# Altium schematic sheet IWatch_MB.SchDoc
size A2; DocStatus: Draft
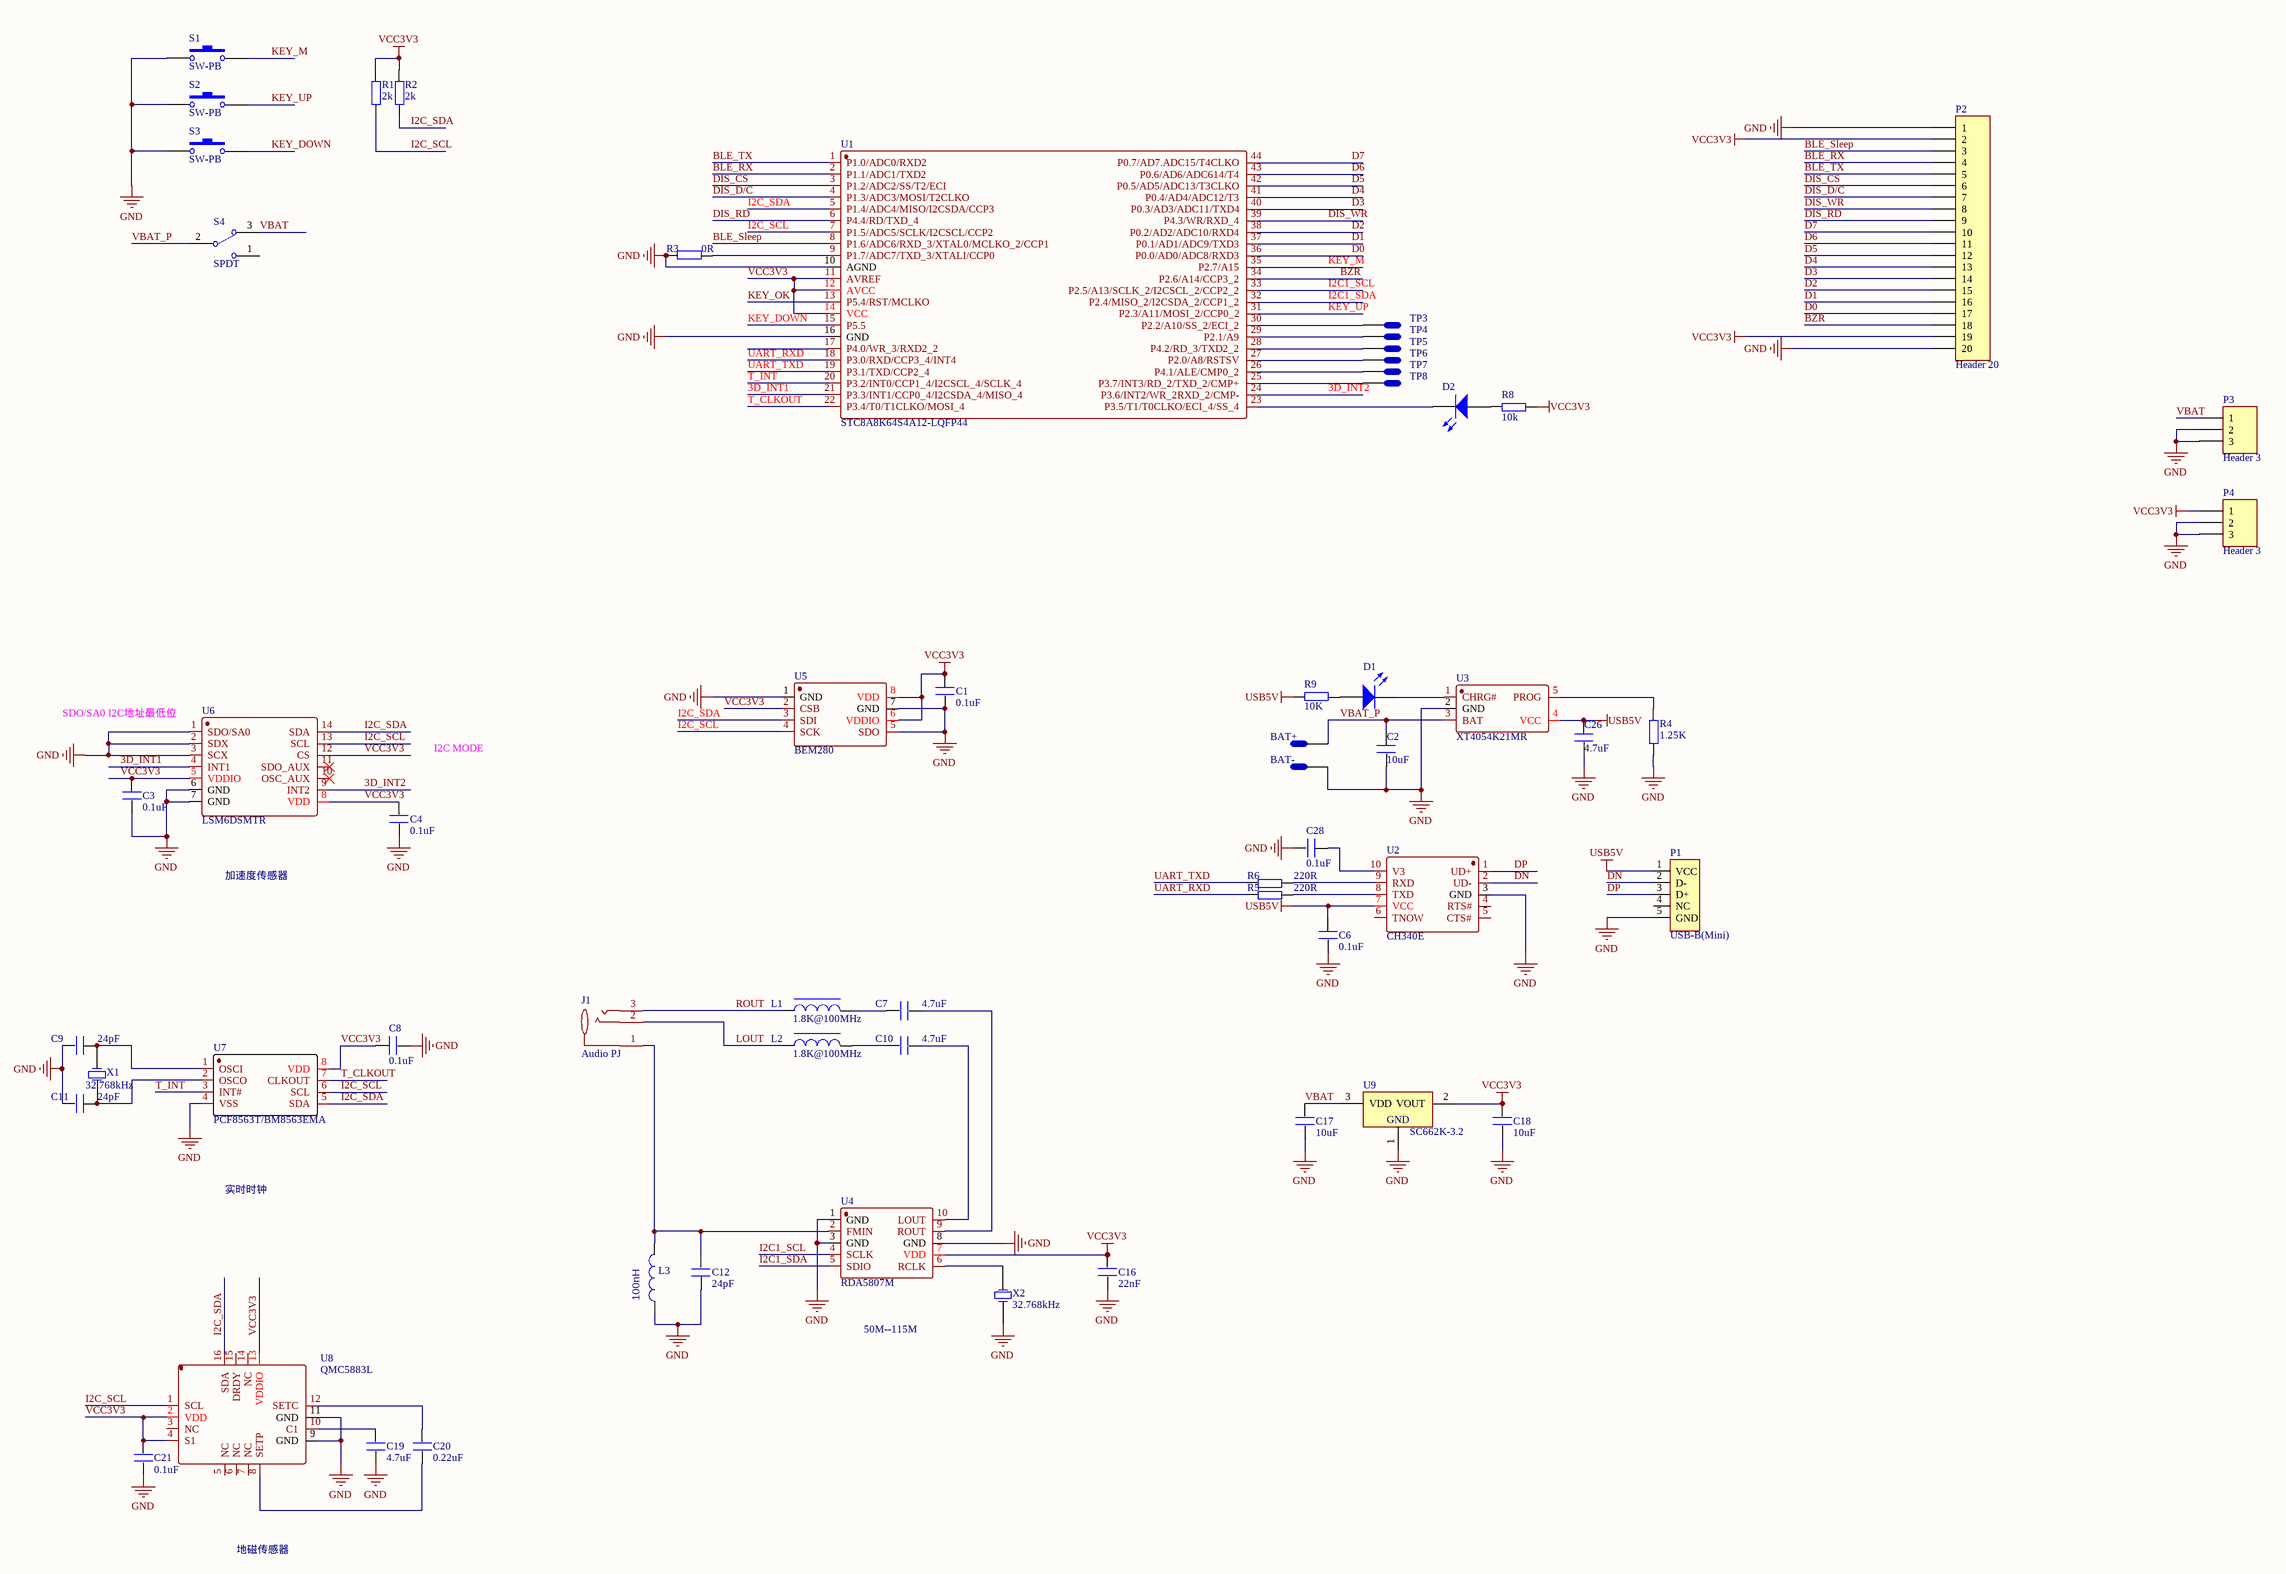
[diagram p0: IWatch_MB.SchDoc]

## Parts
BAT+  TP  [TP_1mm]  (value not drawn)
BAT-  TP  [TP_1mm]  (value not drawn)
C1  0.1uF  [C0603]
C2  10uF  [C0603]
C3  0.1uF  [C0603]
C4  0.1uF  [C0603]
C6  0.1uF  [C0603]
C7  4.7uF  [C0603]
C8  0.1uF  [C0603]
C9  24pF  [C0603]
C10  4.7uF  [C0603]
C11  24pF  [C0603]
C12  24pF  [C0603]
C16  22nF  [C0603]
C17  10uF  [C0603]
C18  10uF  [C0603]
C19  4.7uF  [C0603]
C20  0.22uF  [C0603]
C21  0.1uF  [C0603]
C26  4.7uF  [C0603]
C28  0.1uF  [C0603]
D1  LED0  [LED_0603]  (value not drawn)
D2  LED0  [LED_0603]  (value not drawn)
J1  Audio PJ  [Audio PJ]
L1  1.8K@100MHz  [R0603]
L2  1.8K@100MHz  [R0603]
L3  100nH  [R0603]
P1  USB-B(Mini)  [MICRO_USB5P_带牛角]
P2  Header 20  [HDR_1X20P_1.27MM]
P3  Header 3  [HDR_1X3P_1.27MM]
P4  Header 3  [HDR_1X3P_1.27MM]
R1  2k  [R0603]
R2  2k  [R0603]
R3  0R  [R0603]
R4  1.25K  [R0603]
R5  220R  [R0603]
R6  220R  [R0603]
R8  10k  [R0603]
R9  10K  [R0603]
S1  SW-PB  [Button_3x6x3.5mm]
S2  SW-PB  [Button_3x6x3.5mm]
S3  SW-PB  [Button_3x6x3.5mm]
S4  SPDT  [SW-SK12D07_三脚两档]
TP3  TP  [TP_1mm]  (value not drawn)
TP4  TP  [TP_1mm]  (value not drawn)
TP5  TP  [TP_1mm]  (value not drawn)
TP6  TP  [TP_1mm]  (value not drawn)
TP7  TP  [TP_1mm]  (value not drawn)
TP8  TP  [TP_1mm]  (value not drawn)
U1  STC8A8K64S4A12-LQFP44
U2  CH340E  [MSOP-10]
U3  XT4054K21MR  [SOT23-5]
U4  RDA5807M  [MSOP-10]
U5  BEM280  [LGA-8]
U6  LSM6DSMTR  [LGA-14L]
U7  PCF8563T/BM8563EMA  [MSOP8]
U8  QMC5883L  [LGA-16]
U9  SC662K-3.2  [SOT23-3]
X1  32.768kHz  [XTAL_2012_2P]
X2  32.768kHz  [XTAL_2012_2P]

## Nets
GND: BAT-.1(TP?) C1.1 C2.1 C3.1 C4.1 C6.1 C8.2 C9.2 C11.2 C12.2 C16.1 C17.1 C18.1 C19.2 C21.1 C26.1 C28.2 L3.1 P1.5(GND) P2.1 P2.20 P3.2 P3.3 P4.2 P4.3 R3.2 R4.1 S1.1 S2.1 S3.1 U1.10(AGND) U1.16(GND) U2.3(GND) U3.2(GND) U4.1(GND) U4.3(GND) U4.8(GND) U5.1(GND) U5.5(SDO) U5.7(GND) U6.1(SDO/SA0) U6.2(SDX) U6.3(SCX) U6.6(GND) U6.7(GND) U7.4(VSS) U8.9(GND) U8.11(GND) U9.1(GND) X2.1(OSC1)
USB5V: C6.2 C26.2 P1.1(VCC) R9.2 U2.7(VCC) U3.4(VCC)
VCC3V3: C1.2 C3.2 C4.2 C8.1 C16.2 C18.2 C21.2 P2.2 P2.19 P4.1 R1.2 R2.2 R8.2 U1.11(AVREF) U1.12(AVCC) U1.14(VCC) U4.7(VDD) U5.2(CSB) U5.6(VDDIO) U5.8(VDD) U6.5(VDDIO) U6.8(VDD) U6.12(CS) U7.8(VDD) U8.2(VDD) U8.4(S1) U8.13(VDDIO) U9.2(VOUT)
3D_INT1: U1.21(P3.3/INT1/CCP0_4/I2CSDA_4/MISO_4) U6.4(INT1)
3D_INT2: U1.24(P3.6/INT2/WR_2RXD_2/CMP-) U6.9(INT2)
BLE_RX: P2.4 U1.2(P1.1/ADC1/TXD2)
BLE_Sleep: P2.3 U1.8(P1.6/ADC6/RXD_3/XTAL0/MCLKO_2/CCP1)
BLE_TX: P2.5 U1.1(P1.0/ADC0/RXD2)
BZR: P2.18 U1.34(P2.6/A14/CCP3_2)
D0: P2.17 U1.36(P0.0/AD0/ADC8/RXD3)
D1: P2.16 U1.37(P0.1/AD1/ADC9/TXD3)
D2: P2.15 U1.38(P0.2/AD2/ADC10/RXD4)
D3: P2.14 U1.40(P0.3/AD3/ADC11/TXD4)
D4: P2.13 U1.41(P0.4/AD4/ADC12/T3)
D5: P2.12 U1.42(P0.5/AD5/ADC13/T3CLKO)
D6: P2.11 U1.43(P0.6/AD6/ADC614/T4)
D7: P2.10 U1.44(P0.7/AD7.ADC15/T4CLKO)
DIS_CS: P2.6 U1.3(P1.2/ADC2/SS/T2/ECI)
DIS_D/C: P2.7 U1.4(P1.3/ADC3/MOSI/T2CLKO)
DIS_RD: P2.9 U1.6(P4.4/RD/TXD_4)
DIS_WR: P2.8 U1.39(P4.3/WR/RXD_4)
DN: P1.2(D-) U2.2(UD-)
DP: P1.3(D+) U2.1(UD+)
I2C1_SCL: U1.33(P2.5/A13/SCLK_2/I2CSCL_2/CCP2_2) U4.4(SCLK)
I2C1_SDA: U1.32(P2.4/MISO_2/I2CSDA_2/CCP1_2) U4.5(SDIO)
I2C_SCL: R1.1 U1.7(P1.5/ADC5/SCLK/I2CSCL/CCP2) U5.4(SCK) U6.13(SCL) U7.6(SCL) U8.1(SCL)
I2C_SDA: R2.1 U1.5(P1.4/ADC4/MISO/I2CSDA/CCP3) U5.3(SDI) U6.14(SDA) U7.5(SDA) U8.16(SDA)
KEY_DOWN: S3.2 U1.15(P5.5)
KEY_M: S1.2 U1.35(P2.7/A15)
KEY_OK: U1.13(P5.4/RST/MCLKO)
KEY_UP: S2.2 U1.31(P2.3/A11/MOSI_2/CCP0_2)
LOUT: J1.2 L2.1
ROUT: J1.3 L1.1
T_CLKOUT: U1.22(P3.4/T0/T1CLKO/MOSI_4) U7.7(CLKOUT)
T_INT: U1.20(P3.2/INT0/CCP1_4/I2CSCL_4/SCLK_4) U7.3(INT#)
UART_RXD: R5.1 U1.18(P3.0/RXD/CCP3_4/INT4)
UART_TXD: R6.1 U1.19(P3.1/TXD/CCP2_4)
VBAT: C17.2 P3.1 S4.3 U9.3(VDD)
VBAT_P: BAT+.1(TP?) C2.2 S4.2 U3.3(BAT)
NetC7_1: C7.1 U4.9(ROUT)
NetC7_2: C7.2 L1.2
NetC9_1: C9.1 U7.1(OSCI) X1.1(OSC1)
NetC10_1: C10.1 U4.10(LOUT)
NetC10_2: C10.2 L2.2
NetC11_1: C11.1 U7.2(OSCO) X1.2(OSC2)
NetC12_1: C12.1 J1.1 L3.2 U4.2(FMIN)
NetC19_1: C19.1 U8.10(C1)
NetC20_1: C20.1 U8.12(SETC)
NetC20_2: C20.2 U8.8(SETP)
NetC28_1: C28.1 U2.10(V3)
NetD1_1: D1.1(A) R9.1
NetD1_2: D1.2(K) U3.1(CHRG#)
NetD2_1: D2.1(A) R8.1
NetD2_2: D2.2(K) U1.23(P3.5/T1/T0CLKO/ECI_4/SS_4)
NetR3_1: R3.1 U1.9(P1.7/ADC7/TXD_3/XTALI/CCP0)
NetR4_2: R4.2 U3.5(PROG)
NetR5_2: R5.2 U2.8(TXD)
NetR6_2: R6.2 U2.9(RXD)
NetTP3_1: TP3.1(TP?) U1.30(P2.2/A10/SS_2/ECI_2)
NetTP4_1: TP4.1(TP?) U1.29(P2.1/A9)
NetTP5_1: TP5.1(TP?) U1.28(P4.2/RD_3/TXD2_2)
NetTP6_1: TP6.1(TP?) U1.27(P2.0/A8/RSTSV)
NetTP7_1: TP7.1(TP?) U1.26(P4.1/ALE/CMP0_2)
NetTP8_1: TP8.1(TP?) U1.25(P3.7/INT3/RD_2/TXD_2/CMP+)
NetU4_6: U4.6(RCLK) X2.2(OSC2)

Not connected (* = marked no-connect by the designer): P1 4(NC); S4 1; U1 17(P4.0/WR_3/RXD2_2); U2 4(RTS#) 5(CTS#) 6(TNOW); U6 10(OSC_AUX)* 11(SDO_AUX)*; U8 3(NC) 5(NC) 6(NC) 7(NC) 14(NC) 15(DRDY)

## Notes on the sheet
- SDO/SA0 I2C地址最低位
- I2C MODE
- 加速度传感器
- 实时时钟
- 50M--115M
- 地磁传感器
- Title
- Size:
- Date:
- File:
- A2
- Number:
- Time:
- Revision:
- Sheet
- of

## Library data of the parts
BAT+ BAT- TP3-TP8 = TP: TEST POINT
C1-C4 C6-C12 C16-C21 C26 C28 = C
D1 D2 = LED0: Typical INFRARED GaAs LED; Published: 8-Jun-2000; LatestRevisionDate: 08-Jul-2005; LatestRevisionNote: Mech Layer 1 removed.; PackageReference: LED-0; Publisher: Altium Limited; PackageDescription: LED; 2 Leads
L1 L2 = INDUCTOR_2: 铁心电感; ID: *
L3 = INDUCTOR: ID: 11060000x; Type: 贴片电感; Value: 1uH; Manufacture: *; Footprint: *; Accurary: *; Irms: *
P1 = USB5
P2 = Header 20: Header, 20-Pin; LatestRevisionDate: 17-Jul-2002; LatestRevisionNote: Re-released for DXP Platform.; Publisher: Altium Limited
P3 P4 = Header 3: Header, 3-Pin; LatestRevisionDate: 17-Jul-2002; LatestRevisionNote: Re-released for DXP Platform.; Publisher: Altium Limited
R1-R6 R8 R9 = R
S1-S3 = SW-PB: Switch; Published: 24-Mar-1999; LatestRevisionDate: 17-Jul-2002; LatestRevisionNote: Re-released for DXP Platform.; PackageReference: SPST-2; Publisher: Altium Limited; PackageDescription: Switch; 2 Leads
S4 = SPDT: Single-Pole Double-Throw; Manufacture: NKK Switches; ID: 112500001; Order No: MS12ASW30; Alternative: TS-13P; Type: 机械开关; Footprint: 三脚12.7mmx9.53mm; Voltage: *; Irms: *
U4 = RDA5807M: SINGLE-CHIP BROADCAST FM RADIO TUNER
U5 = BEM280: Integrated Environmental Unit
U6 = LSM6DSMTR: 3D accelerometer and 3D gyroscope
U7 = PCF8563: Real-time clock/calendar
U8 = QMC5883L: 3-Axis Magnetic Sensor
U9 = SC662K-3.2: Low Dropout,  250mA
X1 X2 = XTAL_2